# Altium schematic sheet Jukebox Memory.SchDoc: Jukebox Memory
size B; DrawnBy: Tim Menninger; Revision: 1.1; SheetNumber: 4; SheetTotal: 5
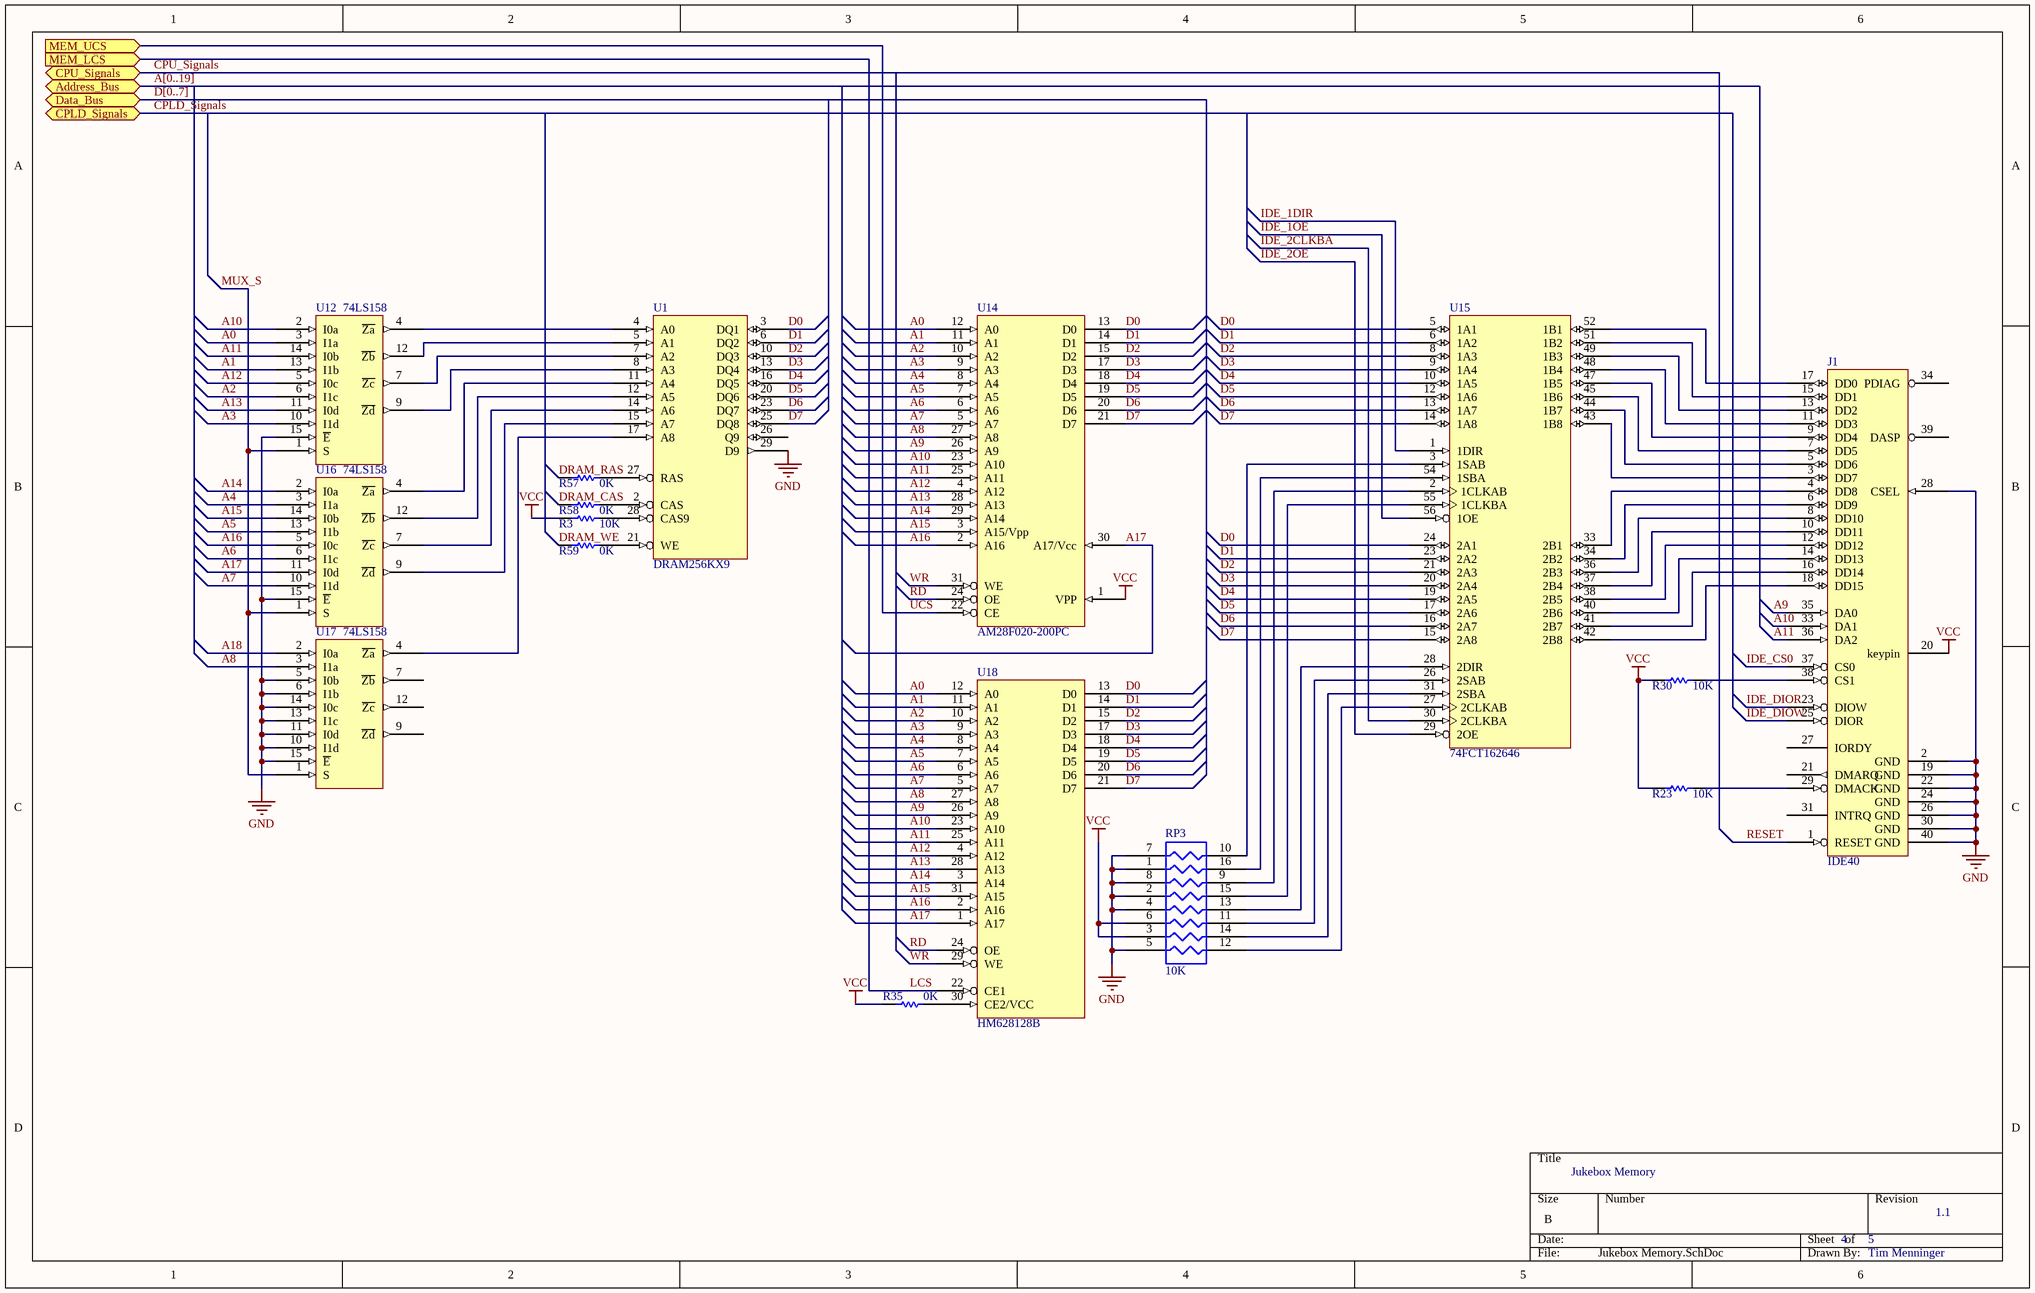
[diagram p0: Jukebox Memory.SchDoc]

## Parts
J1  IDE40  [SIP2X20]
R3  value 10K  [6-0805_L]  (hidden comment: Res1)
R23  value 10K  [6-0805_L]  (hidden comment: Res1)
R30  value 10K  [6-0805_L]  (hidden comment: Res1)
R35  value 0K  [6-0805_L]  (hidden comment: Res1)
R57  value 0K  [6-0805_L]  (hidden comment: Res1)
R58  value 0K  [6-0805_L]  (hidden comment: Res1)
R59  value 0K  [6-0805_L]  (hidden comment: Res1)
RP3  10K  [SSOP16]
U1  DRAM256KX9  [SIMM30]
U12  74LS158  [DIPS16]
U14  AM28F020-200PC  [DIPS32]
U15  74FCT162646  [SSOP56]
U16  74LS158  [DIPS16]
U17  74LS158  [DIPS16]
U18  HM628128B  [DIPS32.300]

## Ports
Address_Bus, CPLD_Signals, CPU_Signals, Data_Bus, MEM_LCS (in), MEM_UCS (in)

## Nets
GND: J1.2(GND) J1.19(GND) J1.22(GND) J1.24(GND) J1.26(GND) J1.28(CSEL) J1.30(GND) J1.40(GND) RP3.1 RP3.2 RP3.4 RP3.5 RP3.7 RP3.8 U1.9(GND) U1.22(GND) U1.29(D9) U12.8(GND) U12.15(~{E}) U14.16(GND) U15.4(GND) U15.11(GND) U15.18(GND) U15.25(GND) U15.32(GND) U15.39(GND) U15.46(GND) U15.53(GND) U16.8(GND) U16.15(~{E}) U17.5(I0b) U17.6(I1b) U17.8(GND) U17.10(I1d) U17.11(I0d) U17.13(I1c) U17.14(I0c) U17.15(~{E}) U18.16(GND)
VCC: J1.20(keypin) R3.2 R23.2 R30.2 R35.2 RP3.3 RP3.6 U1.1(VCC) U1.30(VCC) U12.16(VCC) U14.1(VPP) U14.32(VCC) U15.7(VCC) U15.22(VCC) U15.35(VCC) U15.50(VCC) U16.16(VCC) U17.16(VCC) U18.32(VCC)
A0: U12.3(I1a) U14.12(A0) U18.12(A0)
A1: U12.13(I1b) U14.11(A1) U18.11(A1)
A2: U12.6(I1c) U14.10(A2) U18.10(A2)
A3: U12.10(I1d) U14.9(A3) U18.9(A3)
A4: U14.8(A4) U16.3(I1a) U18.8(A4)
A5: U14.7(A5) U16.13(I1b) U18.7(A5)
A6: U14.6(A6) U16.6(I1c) U18.6(A6)
A7: U14.5(A7) U16.10(I1d) U18.5(A7)
A8: U14.27(A8) U17.3(I1a) U18.27(A8)
A9: J1.35(DA0) U14.26(A9) U18.26(A9)
A10: J1.33(DA1) U12.2(I0a) U14.23(A10) U18.23(A10)
A11: J1.36(DA2) U12.14(I0b) U14.25(A11) U18.25(A11)
A12: U12.5(I0c) U14.4(A12) U18.4(A12)
A13: U12.11(I0d) U14.28(A13) U18.28(A13)
A14: U14.29(A14) U16.2(I0a) U18.3(A14)
A15: U14.3(A15/Vpp) U16.14(I0b) U18.31(A15)
A16: U14.2(A16) U16.5(I0c) U18.2(A16)
A17: U14.30(A17/Vcc) U16.11(I0d) U18.1(A17)
A18: U17.2(I0a)
D0: U1.3(DQ1) U14.13(D0) U15.5(1A1) U15.24(2A1) U18.13(D0)
D1: U1.6(DQ2) U14.14(D1) U15.6(1A2) U15.23(2A2) U18.14(D1)
D2: U1.10(DQ3) U14.15(D2) U15.8(1A3) U15.21(2A3) U18.15(D2)
D3: U1.13(DQ4) U14.17(D3) U15.9(1A4) U15.20(2A4) U18.17(D3)
D4: U1.16(DQ5) U14.18(D4) U15.10(1A5) U15.19(2A5) U18.18(D4)
D5: U1.20(DQ6) U14.19(D5) U15.12(1A6) U15.17(2A6) U18.19(D5)
D6: U1.23(DQ7) U14.20(D6) U15.13(1A7) U15.16(2A7) U18.20(D6)
D7: U1.25(DQ8) U14.21(D7) U15.14(1A8) U15.15(2A8) U18.21(D7)
DRAM_CAS: R58.2
DRAM_RAS: R57.2
DRAM_WE: R59.2
IDE_1DIR: U15.1(1DIR)
IDE_1OE: U15.56(1OE)
IDE_2CLKBA: U15.30(2CLKBA)
IDE_2OE: U15.29(2OE)
IDE_CS0: J1.37(CS0)
IDE_DIOR: J1.23(DIOW)
IDE_DIOW: J1.25(DIOR)
LCS: U18.22(CE1) ; port MEM_LCS
MUX_S: U12.1(S) U16.1(S) U17.1(S)
RD: U14.24(OE) U18.24(OE)
RESET: J1.1(RESET)
UCS: U14.22(CE) ; port MEM_UCS
WR: U14.31(WE) U18.29(WE)
NetJ1_3: J1.3(DD7) U15.43(1B8)
NetJ1_4: J1.4(DD8) U15.33(2B1)
NetJ1_5: J1.5(DD6) U15.44(1B7)
NetJ1_6: J1.6(DD9) U15.34(2B2)
NetJ1_7: J1.7(DD5) U15.45(1B6)
NetJ1_8: J1.8(DD10) U15.36(2B3)
NetJ1_9: J1.9(DD4) U15.47(1B5)
NetJ1_10: J1.10(DD11) U15.37(2B4)
NetJ1_11: J1.11(DD3) U15.48(1B4)
NetJ1_12: J1.12(DD12) U15.38(2B5)
NetJ1_13: J1.13(DD2) U15.49(1B3)
NetJ1_14: J1.14(DD13) U15.40(2B6)
NetJ1_15: J1.15(DD1) U15.51(1B2)
NetJ1_16: J1.16(DD14) U15.41(2B7)
NetJ1_17: J1.17(DD0) U15.52(1B1)
NetJ1_18: J1.18(DD15) U15.42(2B8)
NetJ1_29: J1.29(DMACK) R23.1
NetJ1_38: J1.38(CS1) R30.1
NetR3_1: R3.1 U1.28(CAS9)
NetR35_1: R35.1 U18.30(CE2/VCC)
NetR57_1: R57.1 U1.27(RAS)
NetR58_1: R58.1 U1.2(CAS)
NetR59_1: R59.1 U1.21(WE)
NetRP3_9: RP3.9 U15.2(1CLKAB)
NetRP3_10: RP3.10 U15.3(1SAB)
NetRP3_11: RP3.11 U15.26(2SAB)
NetRP3_12: RP3.12 U15.27(2CLKAB)
NetRP3_13: RP3.13 U15.28(2DIR)
NetRP3_14: RP3.14 U15.31(2SBA)
NetRP3_15: RP3.15 U15.55(1CLKBA)
NetRP3_16: RP3.16 U15.54(1SBA)
NetU1_4: U1.4(A0) U12.4(~{Za})
NetU1_5: U1.5(A1) U12.12(~{Zb})
NetU1_7: U1.7(A2) U12.7(~{Zc})
NetU1_8: U1.8(A3) U12.9(~{Zd})
NetU1_11: U1.11(A4) U16.4(~{Za})
NetU1_12: U1.12(A5) U16.12(~{Zb})
NetU1_14: U1.14(A6) U16.7(~{Zc})
NetU1_15: U1.15(A7) U16.9(~{Zd})
NetU1_17: U1.17(A8) U17.4(~{Za})

Not connected (* = marked no-connect by the designer): J1 21(DMARQ) 27(IORDY) 31(INTRQ) 34(PDIAG) 39(DASP); U1 26(Q9); U17 7(~{Zb}) 9(~{Zd}) 12(~{Zc})

## Buses and harness runs
bus A[0..19] = port Address_Bus
bus CPLD_Signals = port CPLD_Signals
bus CPU_Signals = port CPU_Signals
bus D[0..7] = port Data_Bus

## Library data of the parts
J1 = IDE40: 40-Pin IDE Connector
R3 R23 R30 R35 R57-R59 = Res1: Resistor; Published: 8-Jun-2000; LatestRevisionDate: 17-Jul-2002; LatestRevisionNote: Re-released for DXP Platform.; PackageReference: AXIAL-0.3; Publisher: Altium Limited; PackageDescription: Axial Device, Thru-Hole; 2 Leads; 0.3 in Pin Spacing
RP3 = RPACK8: Resistor Pack - 8 Resistors
U1 = DRAM256KX9: 256K x 9 DRAM SIMM
U14 = UNIROM: Universal EPROM/EEROM Socket
U15 = 74FCT16646: 16-Bit Bus Transceiver/Register
U18 = UNIRAM: Universal RAM Socket